# EasyEDA schematic HUB_MPN_MCDV_MMCH.json

## Sheets
1 Sheet_1: TITLE: MPN - Circuitos alimentação; REV: 1.0; Date: 2026-01-05; Sheet: 1/1; Company: MRS Logística
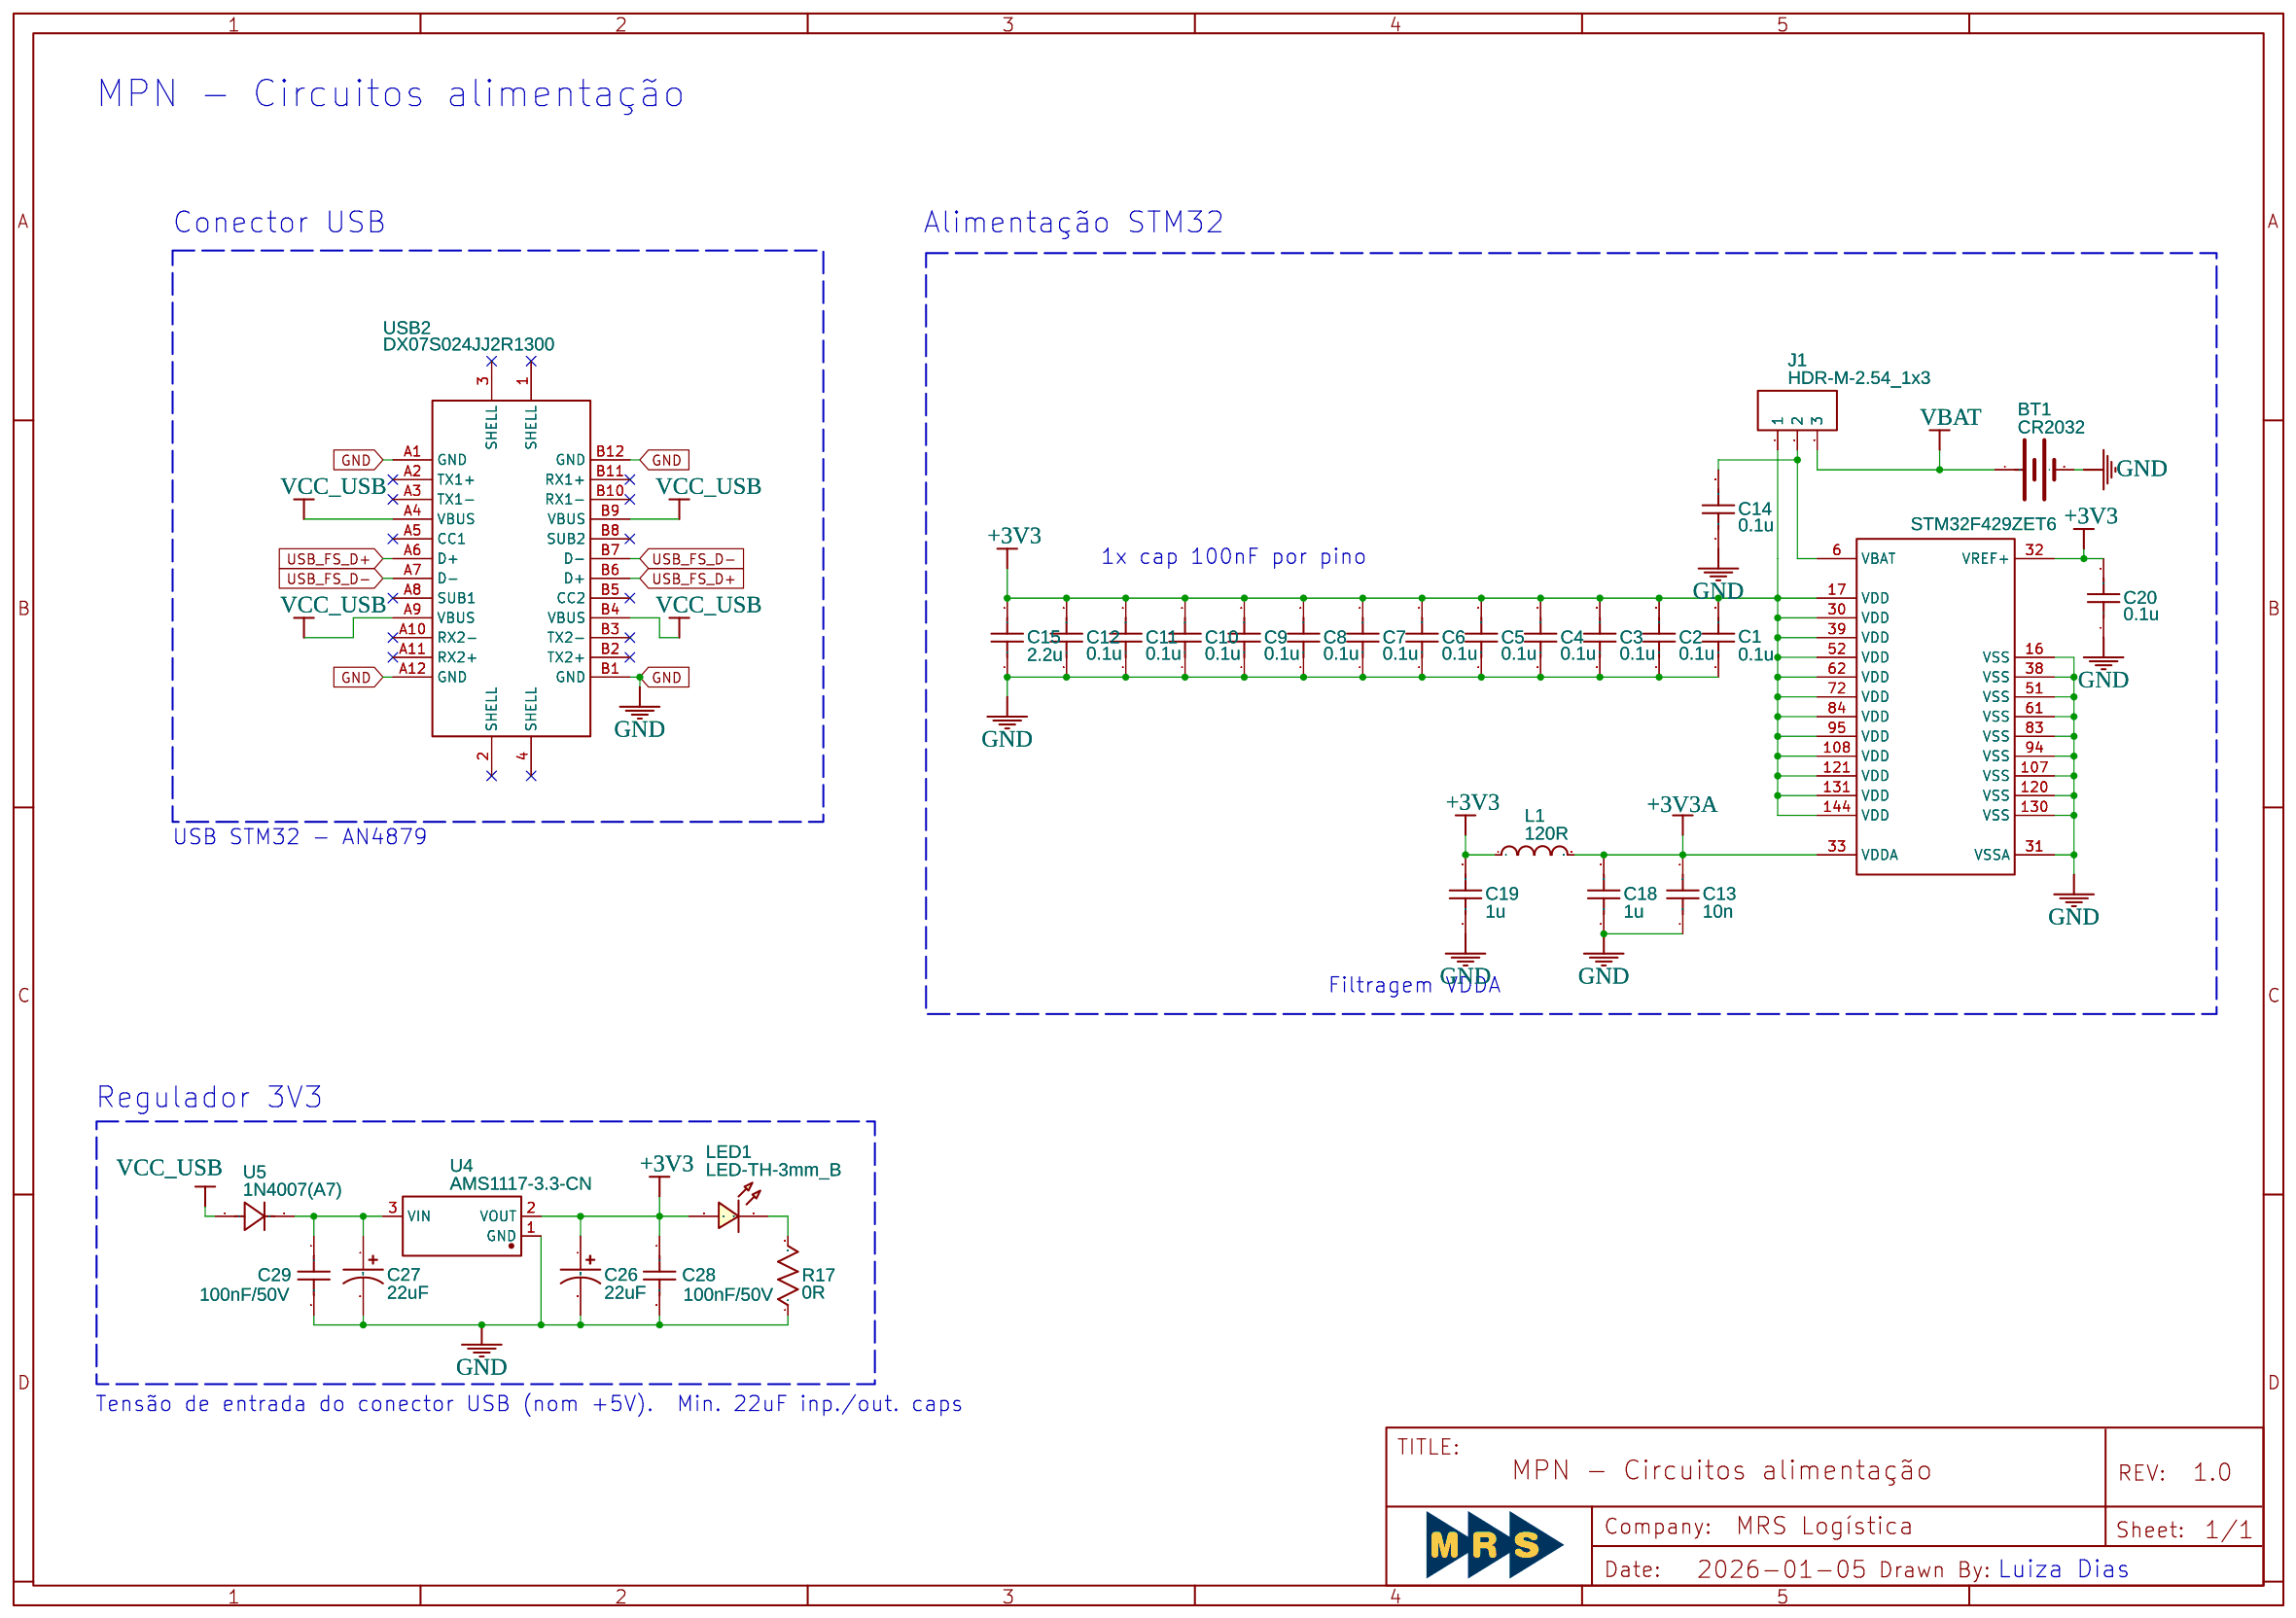
[diagram p0: Sheet_1]
2 Sheet_2: TITLE: MPN - Circuitos STM32 1
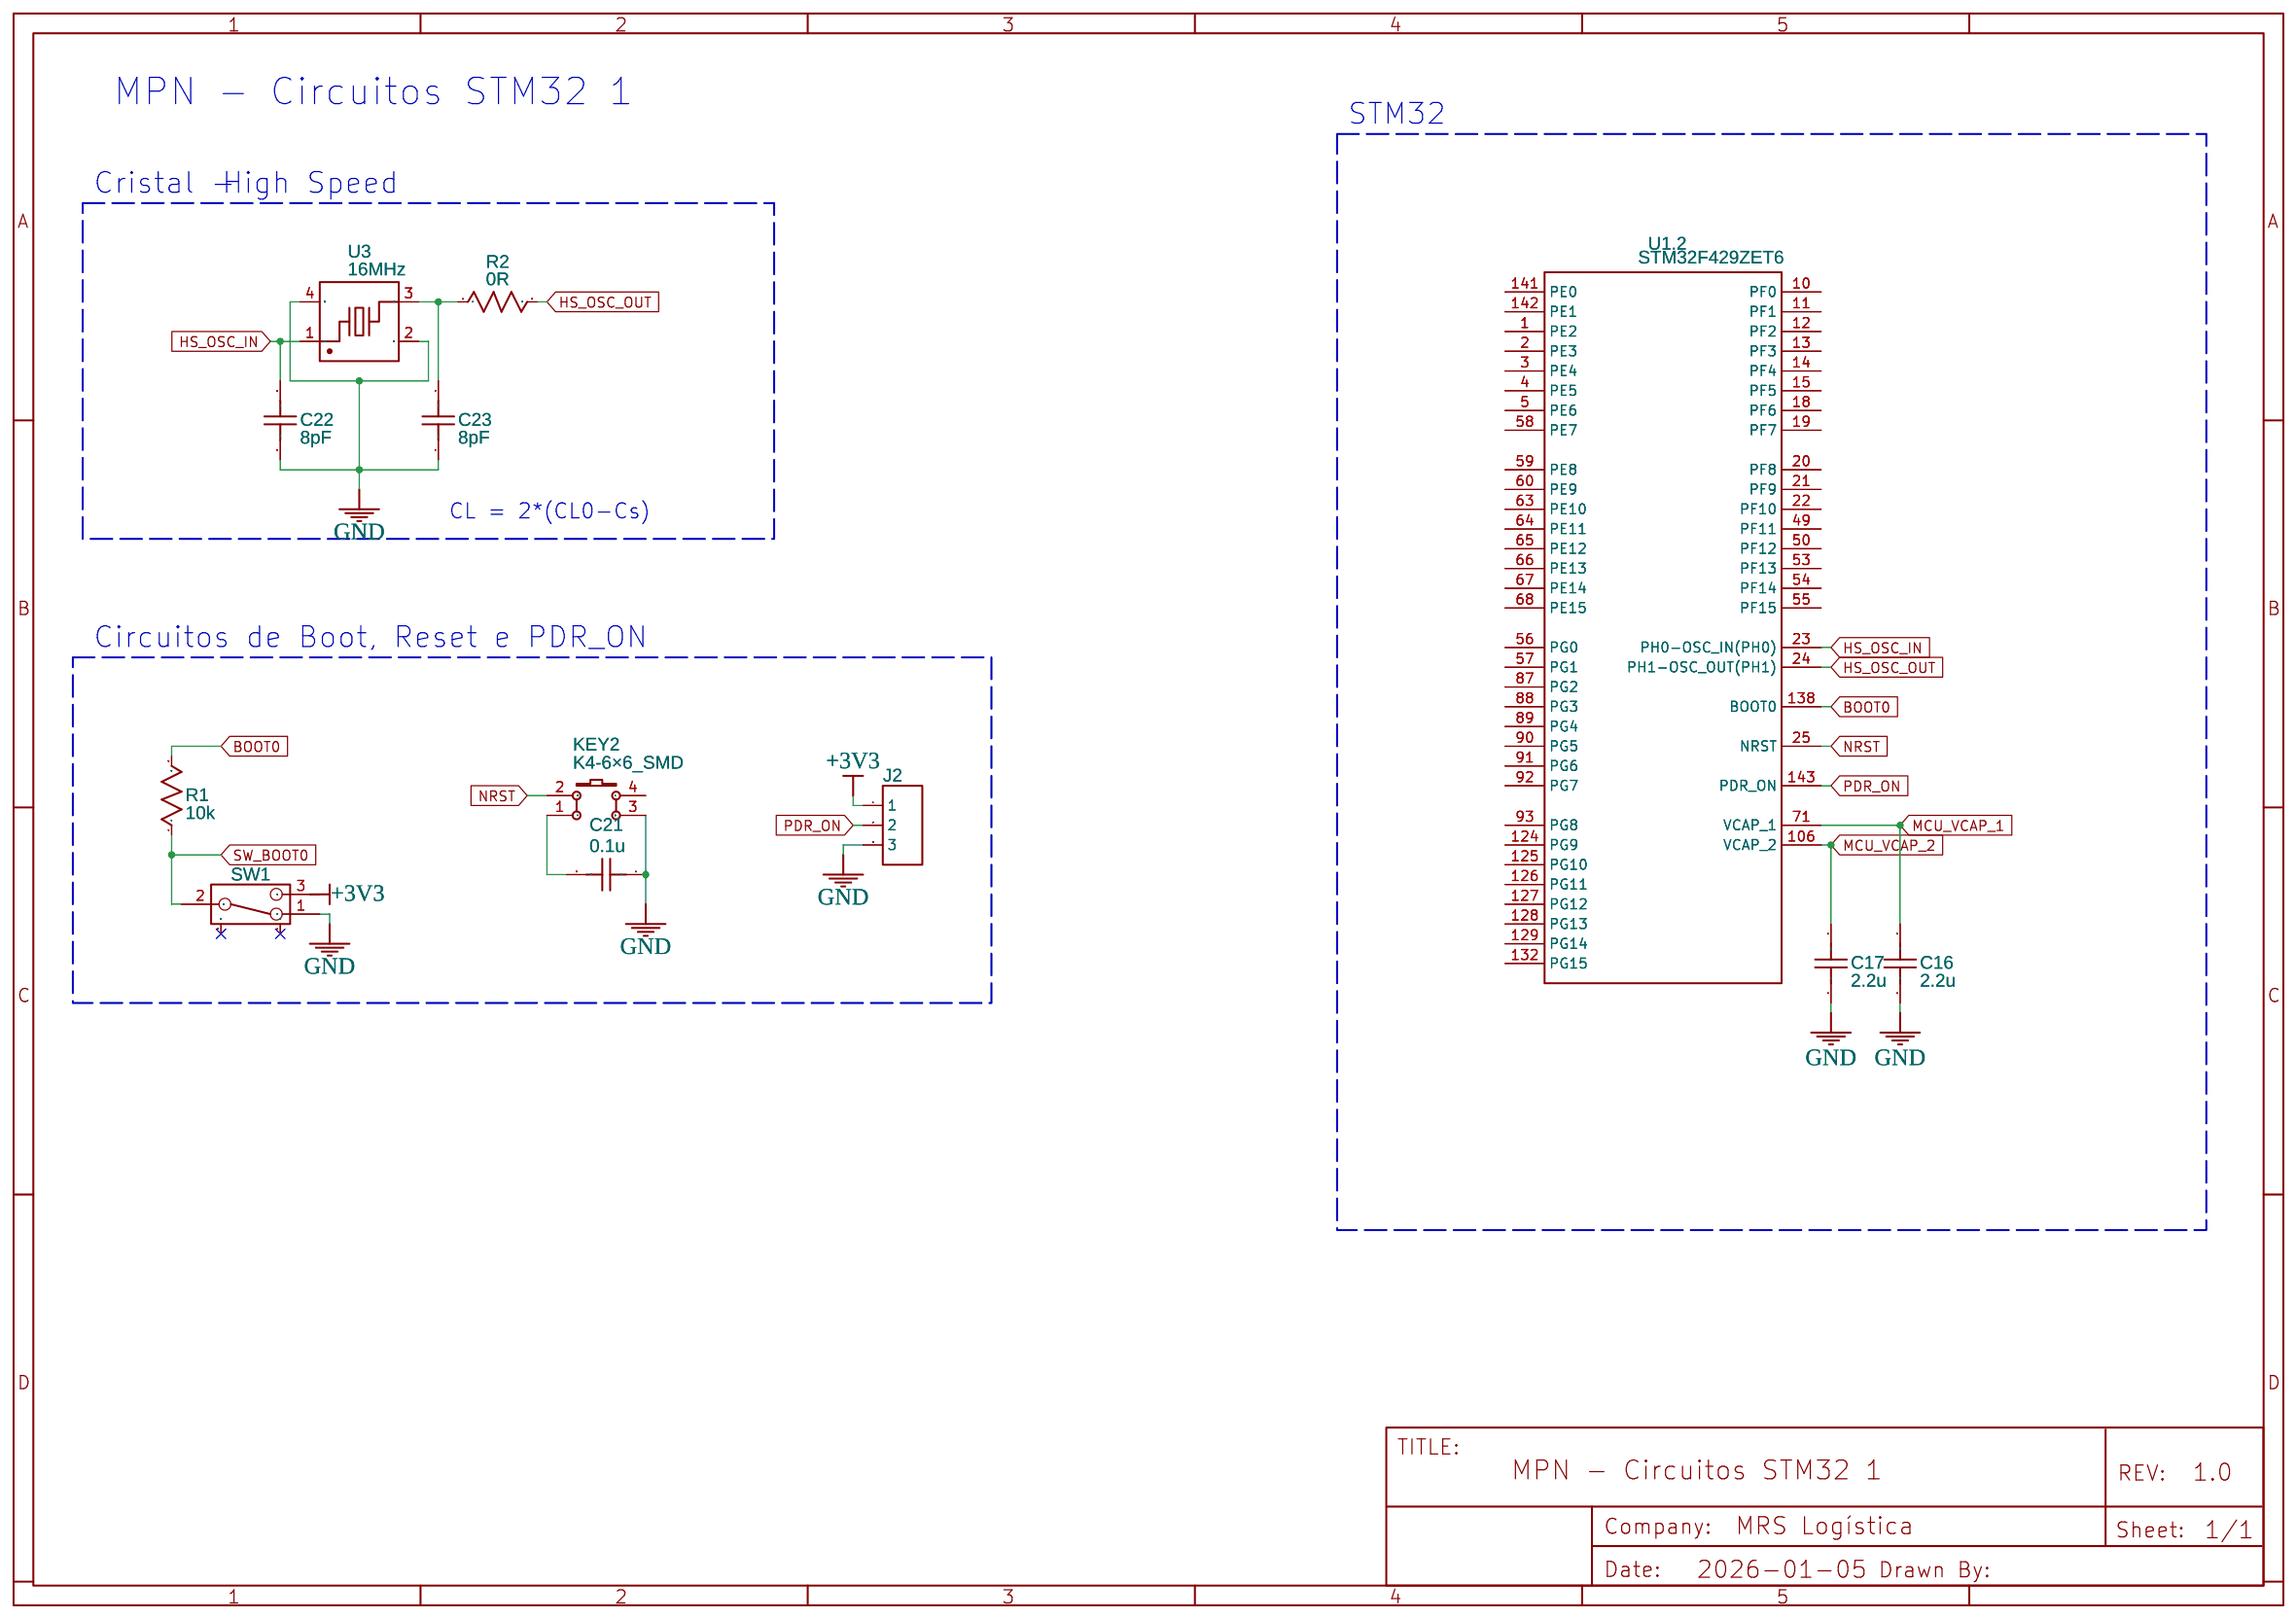
[diagram p1: Sheet_2]
3 Sheet_3: TITLE: MPN - Circuitos  STM32 2
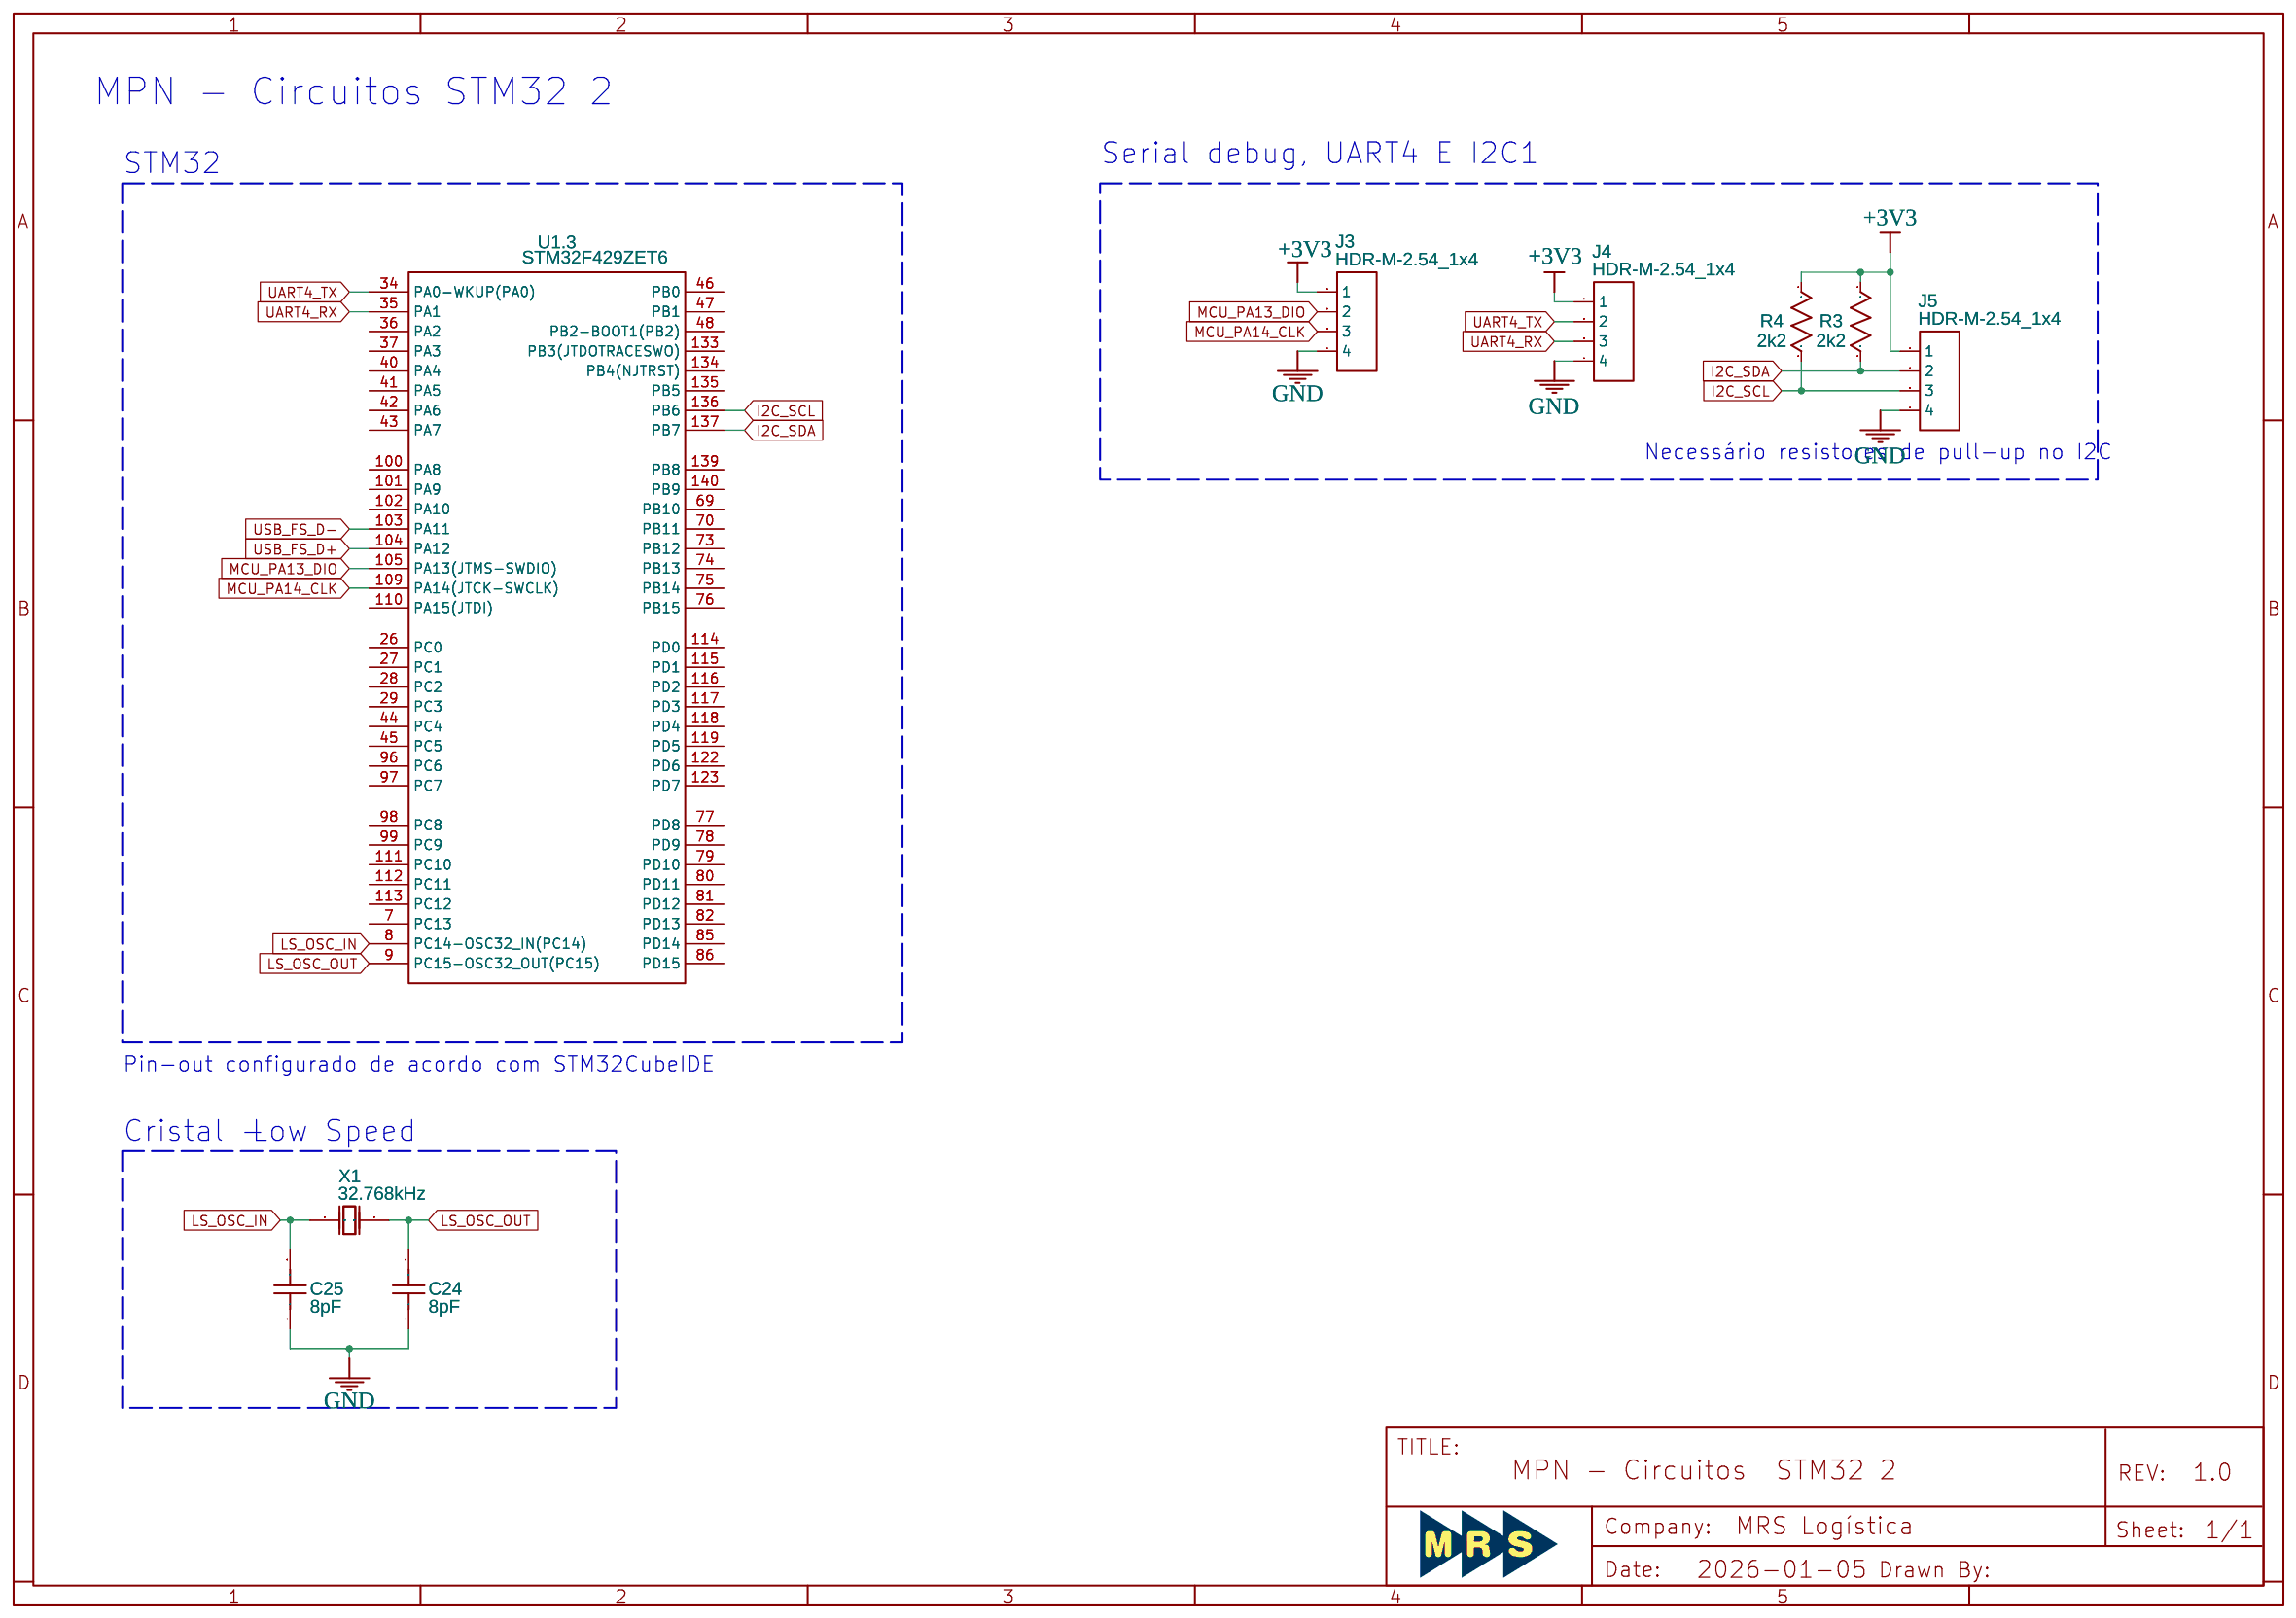
[diagram p2: Sheet_3]

## Parts
sheet Sheet_1
BT1  CR2032  [BAT-TH_XDBS-CR2032-9]
C1  0.1u  [C0402]
C2  0.1u  [C0402]
C3  0.1u  [C0402]
C4  0.1u  [C0402]
C5  0.1u  [C0402]
C6  0.1u  [C0402]
C7  0.1u  [C0402]
C8  0.1u  [C0402]
C9  0.1u  [C0402]
C10  0.1u  [C0402]
C11  0.1u  [C0402]
C12  0.1u  [C0402]
C13  10n  [C0603]
C14  0.1u  [C0402]
C15  2.2u  [C0603]
C18  1u  [C0603]
C19  1u  [C0603]
C20  0.1u  [C0402]
C26  22uF  [CASE-C_6032]
C27  22uF  [CASE-C_6032]
C28  100nF/50V  [C1206]
C29  100nF/50V  [C1206]
J1  HDR-M-2.54_1x3  [HDR-M-2.54_1X3]
L1  120R  [L0402]
LED1  LED-TH-3mm_B  [LED-TH_BD3.0_BLUE]
R17  0R  [R0603]
U1  STM32F429ZET6  [LQFP-144_L20.0-W20.0-P0.50-LS22.0-BL]  (sections 1,2,3)
U4  AMS1117-3.3-CN  [SOT-223-3_L6.7-W3.7-P2.30-LS7.0-BR_2]
U5  1N4007(A7)  [SOD-123FL_L2.8-W1.8-LS3.7-RD]
USB2  DX07S024JJ2R1300  [USB-C-SMD_TYPEC-DX07S024JJ2R1300]
sheet Sheet_2
C16  2.2u  [C0603]
C17  2.2u  [C0603]
C21  0.1u  [C0402]
C22  8pF  [C0402]
C23  8pF  [C0402]
J2  HDR-M-2.54_1x3  [HDR-M-2.54_1X3]
KEY2  K4-6×6_SMD  [KEY-SMD_4P-L6.0-W6.0-P3.90-LS10.0]
R1  10k  [R0603]
R2  0R  [R0603]
SW1  SK-12D02-VG5  [SW-TH_SK-12D02VG3]
U3  16MHz  [CRYSTAL-SMD_4P-L3.2-W2.5-BL]
sheet Sheet_3
C24  8pF  [C0402]
C25  8pF  [C0402]
J3  HDR-M-2.54_1x4  [HDR-M-2.54_1X4]
J4  HDR-M-2.54_1x4  [HDR-M-2.54_1X4]
J5  HDR-M-2.54_1x4  [HDR-M-2.54_1X4]
R3  2k2  [R0603]
R4  2k2  [R0603]
X1  32.768kHz  [OSC-SMD_2P-L3.2-W1.5]

## Library data of the parts
BT1 = XDBS-CR2032-9: Supplier: LCSC; Supplier Part: C48687403; Manufacturer: LX(连欣科技); Contributor: lcsc; JLCPCB Part Class: Extended Part
C1-C12 C14 C20-C25 = C_0402_US: Contributor: LCEDA_Lib
C13 C15-C19 = C_0603_US: Contributor: LCEDA_Lib
C26 C27 = C_Tan_SMD_C_US: Contributor: LCEDA_Lib
C28 C29 = C_1206_US: Contributor: LCEDA_Lib
J1 J2 = HDR-M-2.54_1x3: Supplier Part: C180248; Supplier: LCSC; Contributor: LCEDA_Lib
L1 = L0402_US: Contributor: LCEDA_Lib
LED1 = LED-TH-3mm_B: Manufacturer: EVERLIGHT(台湾亿光); Manufacturer Part: 204-10SUBC/S400-A4; Supplier Part: C86881; Supplier: LCSC; Contributor: LCEDA_Lib
R1-R4 R17 = R_0603_US: Contributor: LCEDA_Lib
U1 = STM32F429ZET6: subpart_no: 1; Supplier Part: C84456; Supplier: LCSC; Manufacturer: ST(意法半导体); JLCPCB Part Class: Extended Part
U4 = AMS1117-3.3-CN: Supplier: LCSC; Supplier Part: C45369270; Manufacturer: ChipNobo(无边界); Contributor: lcsc
U5 = 1N4007(A7): Supplier: LCSC; Supplier Part: C2988637; Manufacturer: UMW(友台半导体); Contributor: lcsc; JLCPCB Part Class: Extended Part
USB2 = DX07S024JJ2R1300: Supplier: LCSC; Supplier Part: C2977282; Manufacturer: JAE(日本航空电子); JLCPCB Part Class: Extended Part; Contributor: lcsc
KEY2 = K4-6×6_SMD: Supplier Part: C191626; Supplier: LCSC; Manufacturer: 韩国韩荣; Manufacturer Part: K2-6639SP-D4SC-04; Contributor: LCEDA_Lib
SW1 = SK-12D02-VG5: Supplier: LCSC; Supplier Part: C136722; Manufacturer: Rectangular Connectors - Contacts; Contributor: LCSC
U3 = CF4016M00012: Supplier: LCSC; Supplier Part: C5765974; Manufacturer: JWT(晶威特); Contributor: lcsc; JLCPCB Part Class: Extended Part
J3-J5 = HDR-M-2.54_1x4: Supplier Part: C124378; Supplier: LCSC; Contributor: LCEDA_Lib
X1 = ECS-.327-12.5-34S-TR: Supplier: LCSC; Supplier Part: C7183160; Manufacturer: ECS; JLCPCB Part Class: Extended Part; Contributor: lcsc

## Nets
+3V3: C1.2 C2.2 C3.2 C4.2 C5.2 C6.2 C7.2 C8.2 C9.2 C10.2 C11.2 C12.2 C15.2 C19.2 C20.2 C26.1 C28.1 J1.1 J2.1 J3.1 J4.1 J5.1 L1.1 LED1.1 R3.1 R4.1 SW1.3 U1.17(VDD) U1.30(VDD) U1.32(VREF+) U1.39(VDD) U1.52(VDD) U1.62(VDD) U1.72(VDD) U1.84(VDD) U1.95(VDD) U1.108(VDD) U1.121(VDD) U1.131(VDD) U1.144(VDD) U4.2(VOUT)
+3V3A: C13.2 C18.2 L1.2 U1.33(VDDA)
GND: BT1.2(-) C1.1 C2.1 C3.1 C4.1 C5.1 C6.1 C7.1 C8.1 C9.1 C10.1 C11.1 C12.1 C13.1 C14.1 C15.1 C16.1 C17.1 C18.1 C19.1 C20.1 C21.1 C22.1 C23.1 C24.1 C25.1 C26.2 C27.2 C28.2 C29.2 J2.3 J3.4 J4.4 J5.4 KEY2.3 R17.1 SW1.1 U1.16(VSS) U1.31(VSSA) U1.38(VSS) U1.51(VSS) U1.61(VSS) U1.83(VSS) U1.94(VSS) U1.107(VSS) U1.120(VSS) U1.130(VSS) U3.2(GND) U3.4(GND) U4.1(GND) USB2.A1(GND) USB2.A12(GND) USB2.B1(GND) USB2.B12(GND)
VBAT: BT1.1(+) J1.3
VCC_USB: U5.2(A) USB2.A4(VBUS) USB2.A9(VBUS) USB2.B4(VBUS) USB2.B9(VBUS)
BOOT0: R1.2 U1.138(BOOT0)
HS_OSC_IN: C22.2 U1.23(PH0-OSC_IN(PH0)) U3.1
HS_OSC_OUT: R2.2 U1.24(PH1-OSC_OUT(PH1))
I2C_SCL: J5.3 R4.2 U1.136(PB6)
I2C_SDA: J5.2 R3.2 U1.137(PB7)
LS_OSC_IN: C25.2 U1.8(PC14-OSC32_IN(PC14)) X1.1(OSC1)
LS_OSC_OUT: C24.2 U1.9(PC15-OSC32_OUT(PC15)) X1.2(OSC2)
MCU_PA13_DIO: J3.2 U1.105(PA13(JTMS-SWDIO))
MCU_PA14_CLK: J3.3 U1.109(PA14(JTCK-SWCLK))
MCU_VCAP_1: C16.2 U1.71(VCAP_1)
MCU_VCAP_2: C17.2 U1.106(VCAP_2)
NRST: KEY2.2 U1.25(NRST)
PDR_ON: J2.2 U1.143(PDR_ON)
SW_BOOT0: R1.1 SW1.2
UART4_RX: J4.3 U1.35(PA1)
UART4_TX: J4.2 U1.34(PA0-WKUP(PA0))
USB_FS_D+: U1.104(PA12) USB2.A6(D+) USB2.B6(D+)
USB_FS_D-: U1.103(PA11) USB2.A7(D-) USB2.B7(D-)
Net-(C14-2): C14.2 J1.2 U1.6(VBAT)
Net-(C21-2): C21.2 KEY2.1
Net-(C23-2): C23.2 R2.1 U3.3
Net-(C27-1): C27.1 C29.1 U4.3(VIN) U5.1(C)
Net-(LED1-2): LED1.2 R17.2

Not connected (* = marked no-connect by the designer): KEY2 4; SW1 4* 5*; U1 1(PE2) 2(PE3) 3(PE4) 4(PE5) 5(PE6) 7(PC13) 10(PF0) 11(PF1) 12(PF2) 13(PF3) 14(PF4) 15(PF5) 18(PF6) 19(PF7) 20(PF8) 21(PF9) 22(PF10) 26(PC0) 27(PC1) 28(PC2) 29(PC3) 36(PA2) 37(PA3) 40(PA4) 41(PA5) 42(PA6) 43(PA7) 44(PC4) 45(PC5) 46(PB0) 47(PB1) 48(PB2-BOOT1(PB2)) 49(PF11) 50(PF12) 53(PF13) 54(PF14) 55(PF15) 56(PG0) 57(PG1) 58(PE7) 59(PE8) 60(PE9) 63(PE10) 64(PE11) 65(PE12) 66(PE13) 67(PE14) 68(PE15) 69(PB10) 70(PB11) 73(PB12) 74(PB13) 75(PB14) 76(PB15) 77(PD8) 78(PD9) 79(PD10) 80(PD11) 81(PD12) 82(PD13) 85(PD14) 86(PD15) 87(PG2) 88(PG3) 89(PG4) 90(PG5) 91(PG6) 92(PG7) 93(PG8) 96(PC6) 97(PC7) 98(PC8) 99(PC9) 100(PA8) 101(PA9) 102(PA10) 110(PA15(JTDI)) 111(PC10) 112(PC11) 113(PC12) 114(PD0) 115(PD1) 116(PD2) 117(PD3) 118(PD4) 119(PD5) 122(PD6) 123(PD7) 124(PG9) 125(PG10) 126(PG11) 127(PG12) 128(PG13) 129(PG14) 132(PG15) 133(PB3(JTDOTRACESWO)) 134(PB4(NJTRST)) 135(PB5) 139(PB8) 140(PB9) 141(PE0) 142(PE1); USB2 1(SHELL)* 2(SHELL)* 3(SHELL)* 4(SHELL)* A2(TX1+)* A3(TX1-)* A5(CC1)* A8(SUB1)* A10(RX2-)* A11(RX2+)* B2(TX2+)* B3(TX2-)* B5(CC2)* B8(SUB2)* B10(RX1-)* B11(RX1+)*

## Notes on the sheets
sheet 1
- MPN - Circuitos alimentação
- Conector USB
- Alimentação STM32
- 1x cap 100nF por pino
- USB STM32 - AN4879
- Filtragem VDDA
- Regulador 3V3
- Tensão de entrada do conector USB (nom +5V).  Min. 22uF inp./out. caps
- Luiza Dias
sheet 2
- MPN - Circuitos STM32 1
- STM32
- Cristal -
- High Speed
- CL = 2*(CL0-Cs)
- Circuitos de Boot, Reset e PDR_ON
sheet 3
- MPN - Circuitos STM32 2
- Serial debug, UART4 E I2C1
- STM32
- Necessário resistores de pull-up no I2C
- Pin-out configurado de acordo com STM32CubeIDE
- Cristal -
- Low Speed
